# Altium schematic sheet Connector_Sheet.SchDoc
size 420 x 297 mm; SheetNumber: 9; SheetTotal: 9
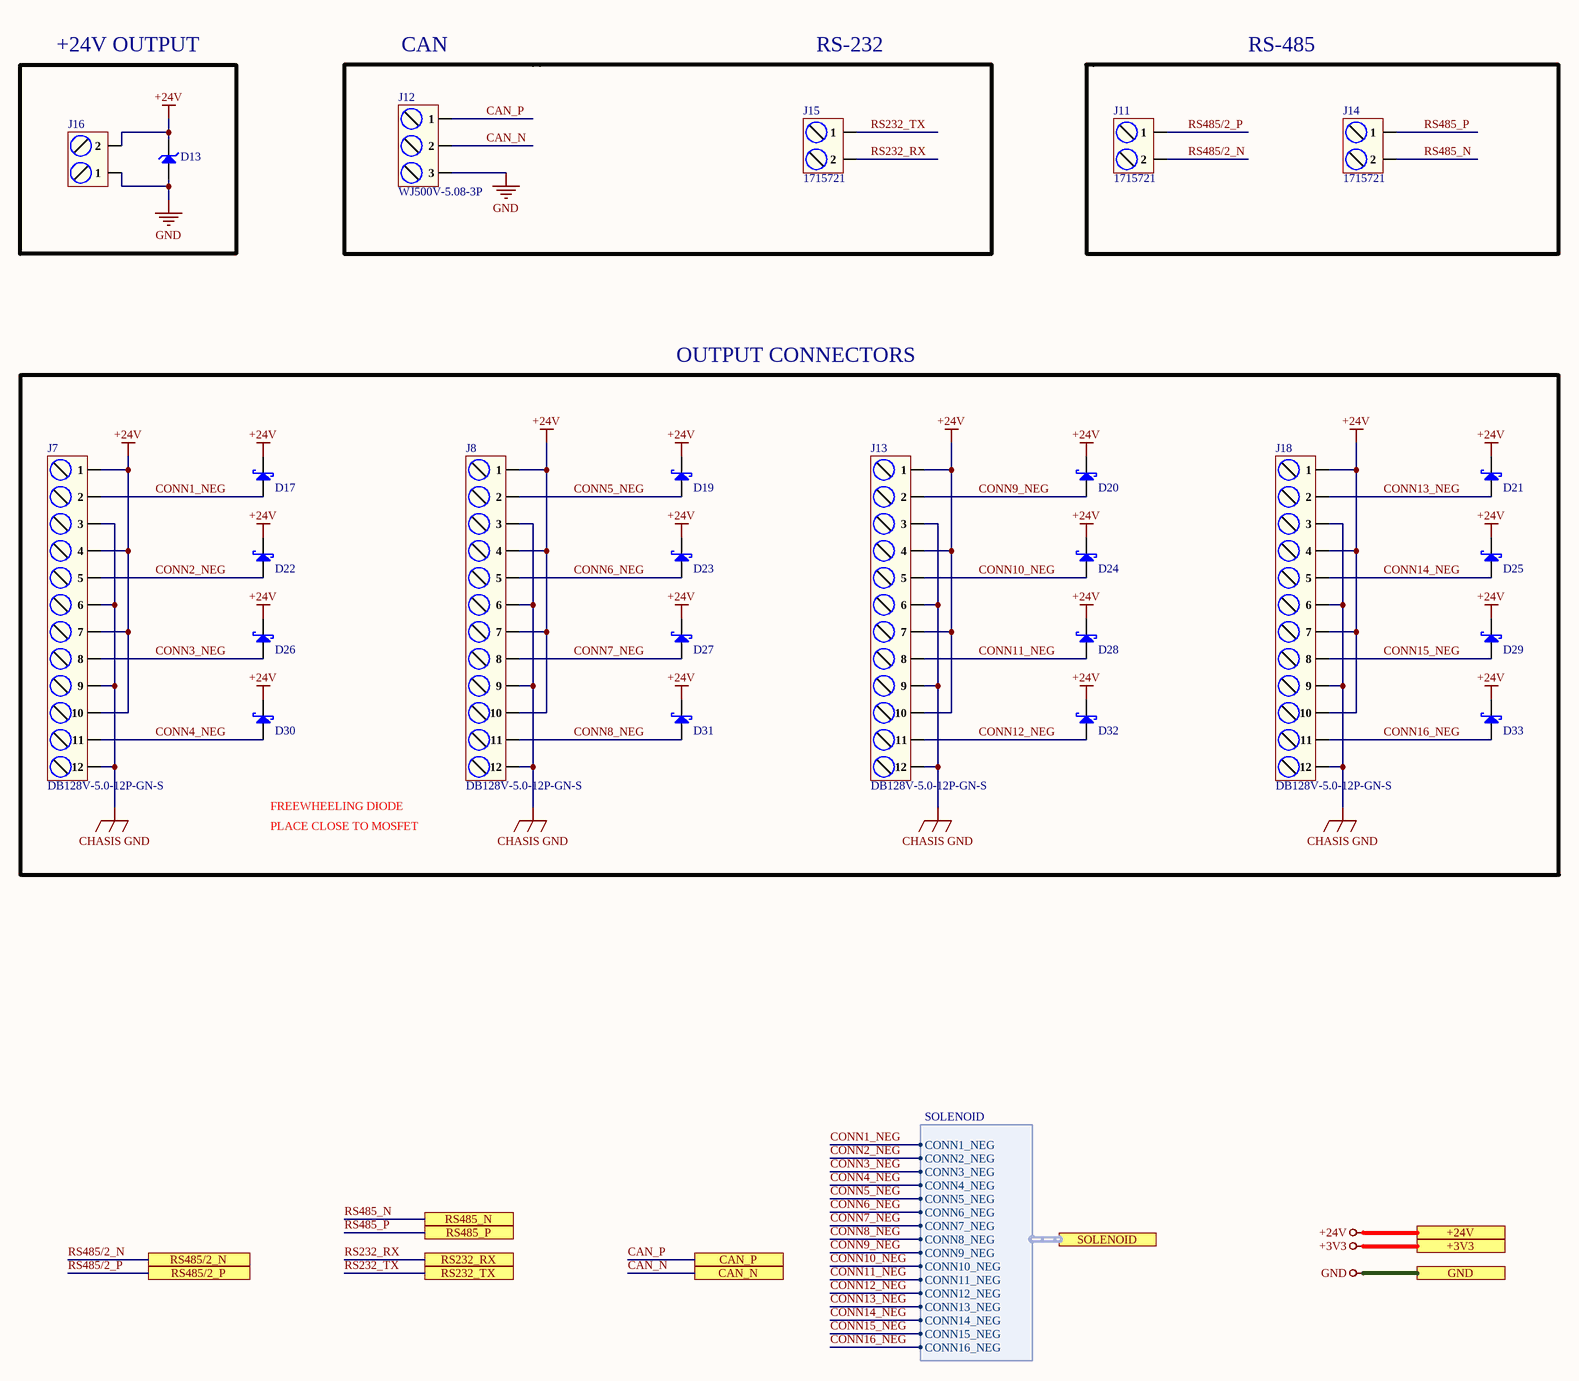
[diagram p0: Connector_Sheet.SchDoc]

## Parts
D13  SMBJ28A-13-F  [SMB_]  (value not drawn)
D17  B150-13-F  [SMA]  (value not drawn)
D19  B150-13-F  [SMA]  (value not drawn)
D20  B150-13-F  [SMA]  (value not drawn)
D21  B150-13-F  [SMA]  (value not drawn)
D22  B150-13-F  [SMA]  (value not drawn)
D23  B150-13-F  [SMA]  (value not drawn)
D24  B150-13-F  [SMA]  (value not drawn)
D25  B150-13-F  [SMA]  (value not drawn)
D26  B150-13-F  [SMA]  (value not drawn)
D27  B150-13-F  [SMA]  (value not drawn)
D28  B150-13-F  [SMA]  (value not drawn)
D29  B150-13-F  [SMA]  (value not drawn)
D30  B150-13-F  [SMA]  (value not drawn)
D31  B150-13-F  [SMA]  (value not drawn)
D32  B150-13-F  [SMA]  (value not drawn)
D33  B150-13-F  [SMA]  (value not drawn)
J7  DB128V-5.0-12P-GN-S  [DB128V-5.0-12P-GN-S]
J8  DB128V-5.0-12P-GN-S  [DB128V-5.0-12P-GN-S]
J11  1715721  [1715721]
J12  WJ500V-5.08-3P  [WJ500V-5.08-3P]
J13  DB128V-5.0-12P-GN-S  [DB128V-5.0-12P-GN-S]
J14  1715721  [1715721]
J15  1715721  [1715721]
J16  MXHB9500-9.5-02P-BK01-Cu-S-A  [MXHB9500-9.5-02P-BK01-Cu-S-A]  (value not drawn)
J18  DB128V-5.0-12P-GN-S  [DB128V-5.0-12P-GN-S]

## Ports
+3V3 (see Top_Sheet[4C], CAN_Sheet[5D], Controller_Sheet[5D], EtherCAT_Sheet[5D], Power_Sheet[5D], RJ45_Sheet[5D], RS485_RS232_Sheet[5D]), +24V (see Top_Sheet[4C], MOSFET_Sheet[5D], Power_Sheet[5D]), CAN_N (see Top_Sheet[4C], CAN_Sheet[3D]), CAN_P (see Top_Sheet[4C], CAN_Sheet[3D]), GND (see Top_Sheet[4C], CAN_Sheet[5D], Controller_Sheet[5D], EtherCAT_Sheet[5D], MOSFET_Sheet[5D], Power_Sheet[5D], RJ45_Sheet[5D], RS485_RS232_Sheet[5D]), RS232_RX (see Top_Sheet[4C], RS485_RS232_Sheet[2D]), RS232_TX (see Top_Sheet[4C], RS485_RS232_Sheet[2D]), RS485/2_N (see Top_Sheet[4C], RS485_RS232_Sheet[1D]), RS485/2_P (see Top_Sheet[4C], RS485_RS232_Sheet[1D]), RS485_N (see Top_Sheet[4C], RS485_RS232_Sheet[2D]), RS485_P (see Top_Sheet[4C], RS485_RS232_Sheet[2D]), SOLENOID (harness SOLENOID, see Top_Sheet[4C], MOSFET_Sheet[2D])

## Harnesses
SOLENOID: CONN1_NEG, CONN2_NEG, CONN3_NEG, CONN4_NEG, CONN5_NEG, CONN6_NEG, CONN7_NEG, CONN8_NEG, CONN9_NEG, CONN10_NEG, CONN11_NEG, CONN12_NEG, CONN13_NEG, CONN14_NEG, CONN15_NEG, CONN16_NEG

## Nets
+3V3: port +3V3
+24V: D13.2(K) D17.1(K) D19.1(K) D20.1(K) D21.1(K) D22.1(K) D23.1(K) D24.1(K) D25.1(K) D26.1(K) D27.1(K) D28.1(K) D29.1(K) D30.1(K) D31.1(K) D32.1(K) D33.1(K) J7.1 J7.4 J7.7 J7.10 J8.1 J8.4 J8.7 J8.10 J13.1 J13.4 J13.7 J13.10 J16.2 J18.1 J18.4 J18.7 J18.10 ; port +24V
CHASIS GND: J7.3 J7.6 J7.9 J7.12 J8.3 J8.6 J8.9 J8.12 J13.3 J13.6 J13.9 J13.12 J18.3 J18.6 J18.9 J18.12
GND: D13.1(A) J12.3 J16.1 ; port GND
CAN_N: J12.2 ; port CAN_N
CAN_P: J12.1 ; port CAN_P
CONN1_NEG: D17.2(A) J7.2 ; port SOLENOID.CONN1_NEG
CONN2_NEG: D22.2(A) J7.5 ; port SOLENOID.CONN2_NEG
CONN3_NEG: D26.2(A) J7.8 ; port SOLENOID.CONN3_NEG
CONN4_NEG: D30.2(A) J7.11 ; port SOLENOID.CONN4_NEG
CONN5_NEG: D19.2(A) J8.2 ; port SOLENOID.CONN5_NEG
CONN6_NEG: D23.2(A) J8.5 ; port SOLENOID.CONN6_NEG
CONN7_NEG: D27.2(A) J8.8 ; port SOLENOID.CONN7_NEG
CONN8_NEG: D31.2(A) J8.11 ; port SOLENOID.CONN8_NEG
CONN9_NEG: D20.2(A) J13.2 ; port SOLENOID.CONN9_NEG
CONN10_NEG: D24.2(A) J13.5 ; port SOLENOID.CONN10_NEG
CONN11_NEG: D28.2(A) J13.8 ; port SOLENOID.CONN11_NEG
CONN12_NEG: D32.2(A) J13.11 ; port SOLENOID.CONN12_NEG
CONN13_NEG: D21.2(A) J18.2 ; port SOLENOID.CONN13_NEG
CONN14_NEG: D25.2(A) J18.5 ; port SOLENOID.CONN14_NEG
CONN15_NEG: D29.2(A) J18.8 ; port SOLENOID.CONN15_NEG
CONN16_NEG: D33.2(A) J18.11 ; port SOLENOID.CONN16_NEG
RS232_RX: J15.2 ; port RS232_RX
RS232_TX: J15.1 ; port RS232_TX
RS485/2_N: J11.2 ; port RS485/2_N
RS485/2_P: J11.1 ; port RS485/2_P
RS485_N: J14.2 ; port RS485_N
RS485_P: J14.1 ; port RS485_P

## Notes on the sheet
- +24V OUTPUT
- CAN
- RS-232
- RS-485
- OUTPUT CONNECTORS
- FREEWHEELING DIODE
- PLACE CLOSE TO MOSFET
- File:
- Title:
- Date:
- Page
- Num:
- Total:
- Drawn By: Huzaifa Ali

## Library data of the parts
D13 = SMBJ28A-13-F: TVS DIODE 28VWM 45.4VC SMB; Manufacturer: Diodes; Test Current: 1mA; Number of Elements: 1; Power Dissipation: 600W; Forward Voltage: 5V; Direction: Unidirectional; Reverse Breakdown Voltage: 31.1V; Max Surge Current: 13.2A; Reverse Standoff Voltage: 28V; Clamping Voltage: 45.4V; Power Line Protection: No; Breakdown Voltage: 35.8V; Max Reverse Leakage Current: 5uA; Value: 330pF; Diode Type: ZENER; Supplier: Future Electronics; Supplier Part Number: 8797342; Manufacturer Part Number: SMBJ28A-13-F; RoHS: Yes; Category: TVS Diodes; Stock: 39000; Pricing: 3000=0.0734, 9000=0.0706, 15000=0.0693, 30000=0.0676, 60000=0.065 (USD); Mounting Technology: Surface Mount; Case/Package: SMB; Pins: 2; Min Operating Temperature: -55°C; Max Operating Temperature: 150°C; Packaging: Tape and Reel; Package Quantity: 3000; Max Power Dissipation: 600W; Series: SMBJ; Number of Unidirectional Channels: 1; Min Breakdown Voltage: 31.1V; Peak Pulse Power: 600W; Polarity: Unidirectional; Termination: SMD/SMT; Peak Pulse Current: 13.2A; Max Breakdown Voltage: 35.8V; Leakage Current: 5uA; Working Voltage: 28V; Voltage Rating (DC): 28V; Max Output current: 13.2A; Clamping Voltage-Max: 45.4V; Length: 4.57mm; Width: 3.9mm; Height: 2.62mm; Radiation Hardening: No; RoHS Compliant: Yes; Lead Free: Lead Free; ComponentLink1URL: https://datasheet.ciiva.com/16387/ds19002-16387564.pdf?src-supplier=Future+Electronics; ComponentLink1Description: https://datasheet.ciiva.com/16387/ds19002-16387564.pdf?src-supplier=Future+Electronics; ComponentLink2URL: https://datasheet.ciiva.com/26912/getdatasheetpartid-234000-26912533.pdf?src-supplier=Verical; ComponentLink2Description: https://datasheet.ciiva.com/26912/getdatasheetpartid-234000-26912533.pdf?src-supplier=Verical; Item Type: Diode
D17 D19-D33 = B150-13-F: DIODE SCHOTTKY 50V 1A SMA; Manufacturer: Diodes Incorporated; Manufacturer Part Number: B150-13-F; Package: SMA(DO-214AC); LCSC Part Number: C134431; Item Type: Diode
J7 J8 J13 J18 = DB128V-5.0-12P-GN-S: 1x12P 20A -40℃~+105℃ 300V Green 12~30 Direct Insert 5mm 2.5 1 12 Plugin,P=5mm Screw Terminal Blocks ROHS; Manufacturer: DORABO; Manufacturer Part Number: DB128V-5.0-12P-GN-S; Package: Plugin,P=5mm; LCSC Part Number: C424688; Item Type: Terminal Block; ComponentLink1Description: LCSC; ComponentLink1URL: https://www.lcsc.com/product-detail/Screw-Terminal-Blocks_DORABO-DB128V-5-0-12P-GN-S_C424688.html
J11 J14 J15 = 1715721: TERM BLK 2P SIDE ENT 5.08MM PCB; Manufacturer: Phoenix Contact; Item Type: Terminal Blocks; Supplier: Digikey; Supplier Part Number: 277-1263-ND; Manufacturer Part Number: 1715721; RoHS: Yes; Stock: 13160; Pricing: 1=0.94 (USD); ComponentLink1URL: https://datasheet.ciiva.com/1120/1697161-1120393.pdf?src-supplier=Farnell; ComponentLink1Description: https://datasheet.ciiva.com/1120/1697161-1120393.pdf?src-supplier=Farnell; ComponentLink2URL: https://datasheet.ciiva.com/832/1715721-832095.pdf?src-supplier=Digikey; ComponentLink2Description: https://datasheet.ciiva.com/832/1715721-832095.pdf?src-supplier=Digikey; ComponentLink3URL: https://datasheet.ciiva.com/15169/getdatasheetpartid-212174-15169929.pdf?src-supplier=Verical; ComponentLink3Description: https://datasheet.ciiva.com/15169/getdatasheetpartid-212174-15169929.pdf?src-supplier=Verical; ComponentLink4URL: https://datasheet.ciiva.com/16046/1715721-16046034.pdf?src-supplier=Onlinecomponents.com; ComponentLink4Description: https://datasheet.ciiva.com/16046/1715721-16046034.pdf?src-supplier=Onlinecomponents.com
J12 = WJ500V-5.08-3P: 1x3P 18A -40℃~+105℃ 250V Green 14~30 Straight pin 5.08mm 2.5 1 3 Plugin,P=5.08mm Screw terminal ROHS; Manufacturer: Ningbo Kangnex Elec; Item Type: Terminal Block; Manufacturer Part Number: WJ500V-5.08-3P; Package: Plugin,P=5.08mm; LCSC Part Number: C72334; ComponentLink1Description: LCSC; ComponentLink1URL: https://www.lcsc.com/product-detail/Screw-terminal_Ningbo-Kangnex-Elec-WJ500V-5-08-3P_C72334.html
J16 = MXHB9500-9.5-02P-BK01-Cu-S-A: Tin 1x2P Corner pin Three sides 2 1 9.5mm -40℃~+105℃ 20A 300V Black 10~22 Copper Alloy 0.5~4 Plugin,P=9.5mm Barrier Terminal Blocks ROHS; Manufacturer: MAX; Manufacturer Part Number: MXHB9500-9.5-02P-BK01-Cu-S-A; Package: Plugin,P=9.5mm; LCSC Part Number: C7542168; Item Type: Terminal Block; ComponentLink1Description: LCSC; ComponentLink1URL: https://www.lcsc.com/product-detail/Barrier-Terminal-Blocks_MAX-MXHB9500-9-5-02P-BK01-Cu-S-A_C7542168.html